# Altium schematic sheet energy_harvesting_board.SchDoc
size 297 x 209 mm
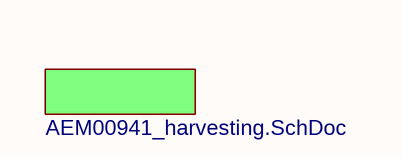
[diagram p0: energy_harvesting_board.SchDoc]

## Sub-sheets
? = AEM00941_harvesting.SchDoc: no entries

## Notes on the sheet
- 1
- 2
- 3
- 4
- 5
- 6
- A
- B
- C
- D
- Title:
- File: energy_harvesting_board.kicad_sch
- Sheet: /
- KiCad E.D.A.  kicad (5.1.4)-1
- Size: A4
- Date:
- Rev:
- Id: 1/1